# Altium project Telemetria.PrjPcb
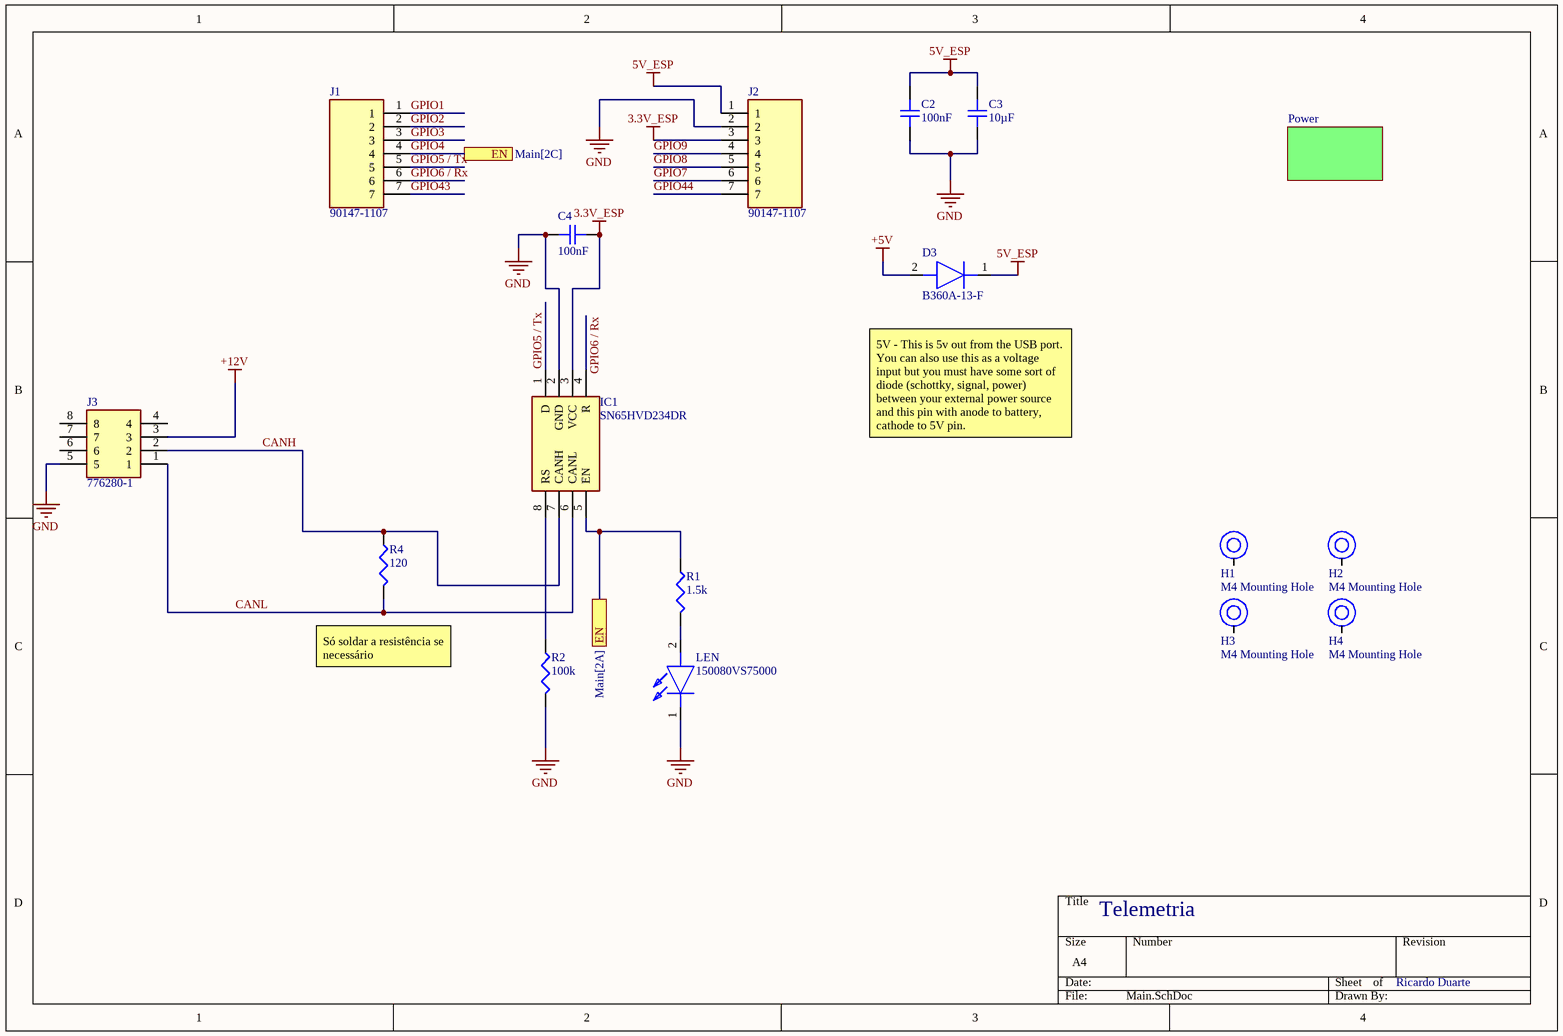
[diagram p0: Main.SchDoc]
2 sheets, 24 parts. Net scope: flat (ports and power ports of the same name join across sheets).
Board file: PCB2.PcbDoc
Sheets:
  Main.SchDoc
     = Power.SchDoc

## Sheet Main.SchDoc
size A4; SheetNumber: 1; SheetTotal: 2

### Parts
C2  100nF  [CAP_0805]
C3  value 10µF  [CAP_0805]  (hidden comment: 10uF)
C4  100nF  [CAP_0805]
D3  B360A-13-F  [FP-SMA-MFG]
H1  M4 Mounting Hole  [M4 Screw Hole-Footprint-1]
H2  M4 Mounting Hole  [M4 Screw Hole-Footprint-1]
H3  M4 Mounting Hole  [M4 Screw Hole-Footprint-1]
H4  M4 Mounting Hole  [M4 Screw Hole-Footprint-1]
IC1  SN65HVD234DR  [SOIC127P600X175-8N]
J1  90147-1107  [SHDR7W65P0X254_1X7_2024X510X1180P]
J2  90147-1107  [SHDR7W65P0X254_1X7_2024X510X1180P]
J3  776280-1  [776280-1]
LEN  150080VS75000  [LEDC2012X80N]
R1  value 1.5k  [RES_0805]  (hidden comment: 4K7)
R2  value 100k  [RES_0805]  (hidden comment: 4K7)
R4  value 120  [RES_0805]  (hidden comment: 4K7)

### Sub-sheets
? = Power: no entries

### Ports
EN (see Main[2A]), EN (see Main[2C])

### Nets
3.3V_ESP: C4.2 IC1.3(VCC) J2.3
5V_ESP: C2.2 C3.2 D3.1(K) J2.1
+5V: D3.2(A)
+12V: J3.3
GND: C2.1 C3.1 C4.1 IC1.2(GND) J2.2 J3.5 LEN.1(K) R2.2
CANH: IC1.7(CANH) J3.2 R4.1
CANL: IC1.6(CANL) J3.1 R4.2
GPIO1: J1.1
GPIO2: J1.2
GPIO3: J1.3
GPIO4: IC1.5(EN) J1.4 R1.1 ; port EN
GPIO5 / Tx: IC1.1(D) J1.5
GPIO6 / Rx: IC1.4(R) J1.6
GPIO7: J2.6
GPIO8: J2.5
GPIO9: J2.4
GPIO43: J1.7
GPIO44: J2.7
NetIC1_8: IC1.8(RS) R2.1
NetLEN_2: LEN.2(A) R1.2

Not connected (* = marked no-connect by the designer): H1 1; H2 1; H3 1; H4 1; J3 4 6 7 8

### Notes on the sheet
- 5V - This is 5v out from the USB port. You can also use this as a voltage input but you must have some sort of diode (schottky, signal, power) between your external power source and this pin with anode to battery, cathode to 5V pin.
- (near R4) Só soldar a resistência se necessário
- Telemetria
- Ricardo Duarte

### Library data of the parts
C2 C4 = CMP-001-00010-2: Ceramic Capacitor, Multilayer, Ceramic, 50V, 20% +Tol, 20% -Tol, X7R, 15% TC, 0.1uF, Surface Mount, 0805; Reference Standard: AEC-Q200; LCSC: *; Rating: *; Rated DC Voltage (URdc): 50V; Min Operating Temperature: -55°C; Mounting Technology: Surface Mount; Case/Package: 0805; Width: 1.25mm; RoHS Compliant: Yes; Temperature Characteristics Code: X7R; Dielectric: *; Value: 100nF; Max Operating Temperature: 125°C; Source: Schematic-Lib-PhilsLab.SchLib; Capacitor Type: Ceramic; Manufacturer: *; Design Item ID: CAP_0805; Manufacturer Part Number: *; Length: 2mm; Distributor Link: *
C3 = CMP-001-00011-2: Ceramic Capacitor, Multilayer, Ceramic, 25V, 10% +Tol, 10% -Tol, X5R, 15% TC, 10uF, Surface Mount, 0805; Reference Standard: AEC-Q200; Design Item ID: CAP_0805; Manufacturer: *; Max Operating Temperature: 85°C; Case/Package: 0805; Rating: *; Distributor Link: *; Min Operating Temperature: -55°C; Mounting Technology: Surface Mount; Rated DC Voltage (URdc): 25V; RoHS Compliant: Yes; Source: Schematic-Lib-PhilsLab.SchLib; Manufacturer Part Number: *; LCSC: *; Capacitor Type: Ceramic; Dielectric: *
D3 = CMP-039-000000-2: Rectifier Diode, Schottky, 1 Phase, 1 Element, 3A, 60V V(RRM), Silicon; Manufacturer_Name: Diodes Inc.; Forward Voltage: 700mV; Design Item ID: B360A-13-F; Mouser Price/Stock: https://www.mouser.co.uk/ProductDetail/Diodes-Incorporated/B360A-13-F?qs=sVoUGXYOGv3xoCWNHVb4bA%3D%3D; Terminal Form: C BEND; Min Operating Temperature: -55°C; Max Operating Temperature: 125°C; Max Output current: 3A; Arrow Part Number: B360A-13-F; RoHS Compliant: Yes; Pins: 2; Mouser Part Number: 621-B360A-F; Terminal Finish: Tin; Manufacturer_Part_Number: B360A-13-F; Diode Type: RECTIFIER; Source: SamacSys.SchLib; Terminal Position: DUAL; Datasheet Link: https://www.diodes.com/assets/Datasheets/ds30891.pdf; Height: 2.4mm; Arrow Price/Stock: https://www.arrow.com/en/products/b360a-13-f/diodes-incorporated?region=asia; Technology: SCHOTTKY; Diode Element Material: SILICON
H1-H4 = CMP-00028-00000-4: IFS Standard M4 hole for mounting PCBs
IC1 = SN65HVD234DR: Integrated Circuit; Manufacturer_Name: Texas Instruments; Datasheet Link: http://www.ti.com/lit/gpn/sn65hvd234; Height: 1.75mm; Manufacturer_Part_Number: SN65HVD234DR; Mouser Part Number: 595-SN65HVD234DR; Mouser Price/Stock: https://www.mouser.co.uk/ProductDetail/Texas-Instruments/SN65HVD234DR?qs=QViXGNcIEAtzI7GJEWw0wA%3D%3D; Arrow Part Number: SN65HVD234DR; Arrow Price/Stock: https://www.arrow.com/en/products/sn65hvd234dr/texas-instruments?region=nac
J1 J2 = 90147-1107: Connector; Manufacturer_Name: Molex; Datasheet Link: https://componentsearchengine.com/Datasheets/2/90147-1107.pdf; Height: 11.8mm; Manufacturer_Part_Number: 90147-1107; Mouser Part Number: 538-90147-1107; Mouser Price/Stock: https://www.mouser.co.uk/ProductDetail/Molex/90147-1107?qs=QESXi79X%252BKpbYN2OdNw17A%3D%3D
J3 = CMP-002-00012-1: Connector; Manufacturer_Name: TE Connectivity; Datasheet Link: https://www.te.com/commerce/DocumentDelivery/DDEController?Action=srchrtrv&DocNm=1-1773979-2&DocType=Data%20Sheet&DocLang=English&PartCntxt=776280-1&DocFormat=pdf; Source: SamacSys.SchLib; Manufacturer_Part_Number: 776280-1; Design Item ID: 776280-1; Arrow Part Number: 776280-1; Arrow Price/Stock: https://www.arrow.com/en/products/776280-1/te-connectivity; Mouser Price/Stock: https://www.mouser.co.uk/ProductDetail/TE-Connectivity/776280-1?qs=tLAa1RwIH6coumJMxuaTDA%3D%3D; Mouser Part Number: 571-776280-1
LEN = CMP-018-000003-2: Single Color LED, Bright Green, Water Clear, 1.4mm; Manufacturer_Name: Wurth Elektronik; Forward Current: 30mA; Luminous Intensity-Nom: 40mcd; Viewing Angle: 140°; Mounting Technology: Surface Mount; Design Item ID: 150080VS75000; Height: 0.8mm; Datasheet Link: http://katalog.we-online.com/led/datasheet/150080VS75000.pdf; Max Operating Temperature: 85°C; Source: SamacSys.SchLib; Color: Green; Min Operating Temperature: -40°C; Mouser Price/Stock: https://www.mouser.co.uk/ProductDetail/Wurth-Elektronik/150080VS75000?qs=LlUlMxKIyB0tGHJmO6%252B0ug%3D%3D; Pins: 2; Size: 1.4mm; Manufacturer_Part_Number: 150080VS75000; Mouser Part Number: 710-150080VS75000; RoHS Compliant: Yes
R1 R2 R4 = CMP-009-00012-1: Resistor SMD 0805 4,7K; Design Item ID: RES_0805; LCSC: *; Distributor Link: *; Source: Schematic-Lib-PhilsLab.SchLib

## Sheet Power.SchDoc
size A4; SheetNumber: 2; SheetTotal: 2
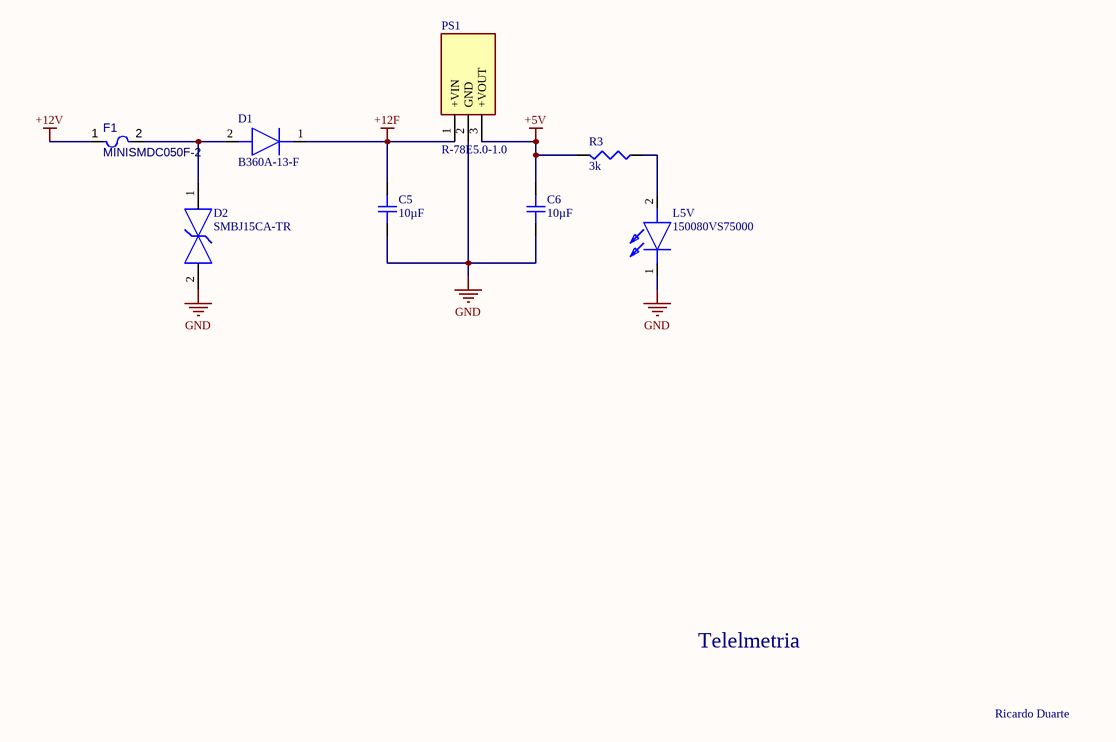
[diagram p1: Power.SchDoc]

### Parts
C5  value 10µF  [CAP_0805]  (hidden comment: 10uF)
C6  value 10µF  [CAP_0805]  (hidden comment: 10uF)
D1  B360A-13-F  [DIOM5226X240N]
D2  SMBJ15CA-TR  [FP-SMB-CA-MFG]
F1  MINISMDC050F-2  [MINISMDC050F-2-Footprint-1]
L5V  150080VS75000  [LEDC2012X80N]
PS1  R-78E5.0-1.0  [R78E5010]
R3  value 3k  [RES_0805]  (hidden comment: 4K7)

### Nets
+5V: C6.2 PS1.3(+VOUT) R3.2
+12F: C5.2 D1.1(K) PS1.1(+VIN)
+12V: F1.1
GND: C5.1 C6.1 D2.2 L5V.1(K) PS1.2(GND)
NetD1_2: D1.2(A) D2.1 F1.2
NetL5V_2: L5V.2(A) R3.1

### Notes on the sheet
- Telelmetria
- Ricardo Duarte

### Library data of the parts
C5 C6 = CMP-001-00011-2: as C3 on sheet Main; Design Item ID: CAP_0805; Manufacturer: *; Max Operating Temperature: 85°C; Case/Package: 0805; Rating: *; Distributor Link: *; Min Operating Temperature: -55°C; Mounting Technology: Surface Mount; Rated DC Voltage (URdc): 25V; RoHS Compliant: Yes; Source: Schematic-Lib-PhilsLab.SchLib; Manufacturer Part Number: *; LCSC: *; Capacitor Type: Ceramic; Dielectric: *
D1 = CMP-039-000000-1: Diode; Manufacturer_Name: Diodes Inc.; Mouser Part Number: 621-B360A-F; Source: SamacSys.SchLib; Datasheet Link: https://www.diodes.com/assets/Datasheets/ds30891.pdf; Manufacturer_Part_Number: B360A-13-F; Arrow Price/Stock: https://www.arrow.com/en/products/b360a-13-f/diodes-incorporated?region=asia; Mouser Price/Stock: https://www.mouser.co.uk/ProductDetail/Diodes-Incorporated/B360A-13-F?qs=sVoUGXYOGv3xoCWNHVb4bA%3D%3D; Design Item ID: B360A-13-F; Arrow Part Number: B360A-13-F; Height: 2.4mm
D2 = CMP-004-00000-1: Trans Voltage Suppressor Diode, 4000W, 15V V(RWM), Bidirectional, 1 Element, Silicon, DO-214AA; Min Operating Temperature: -55°C; Pins: 2; Max Operating Temperature: 150°C; RoHS Compliant: Yes
F1 = CMP-005-00000-2: PTC Resettable Fuse, 24V, Surface Mount; Current Rating: 500mA
L5V = CMP-018-000003-2: as LEN on sheet Main; Mounting Technology: Surface Mount; Design Item ID: 150080VS75000; Height: 0.8mm; Datasheet Link: http://katalog.we-online.com/led/datasheet/150080VS75000.pdf; Max Operating Temperature: 85°C; Source: SamacSys.SchLib; Color: Green; Min Operating Temperature: -40°C; Mouser Price/Stock: https://www.mouser.co.uk/ProductDetail/Wurth-Elektronik/150080VS75000?qs=LlUlMxKIyB0tGHJmO6%252B0ug%3D%3D; Pins: 2; Size: 1.4mm; Manufacturer_Part_Number: 150080VS75000; Mouser Part Number: 710-150080VS75000; RoHS Compliant: Yes
PS1 = R-78E5.0-1.0: Power Supply; Manufacturer_Name: RECOM Power; Datasheet Link: http://www.recom-power.com/pdf/Innoline/R-78Exx-1.0.pdf; Height: 10.4mm; Manufacturer_Part_Number: R-78E5.0-1.0; Mouser Part Number: 919-R-78E5.0-1.0; Mouser Price/Stock: https://www.mouser.co.uk/ProductDetail/RECOM-Power/R-78E5.0-1.0?qs=T0XSgvH75d4EsZCU9I5HVA%3D%3D; Arrow Part Number: R-78E5.0-1.0; Arrow Price/Stock: https://www.arrow.com/en/products/r-78e5.0-1.0/recom-power?utm_currency=USD&region=europe
R3 = CMP-009-00012-1: Resistor SMD 0805 4,7K; Design Item ID: RES_0805; LCSC: *; Distributor Link: *; Source: Schematic-Lib-PhilsLab.SchLib

## Nets that join several sheets
+5V: Main (D3.2), Power (C6.2 PS1.3 R3.2)
+12V: Main (J3.3), Power (F1.1)
GND: Main (8 pins), Power (5 pins)